# EAGLE design spectrumBit (EAGLE 9.5.2)
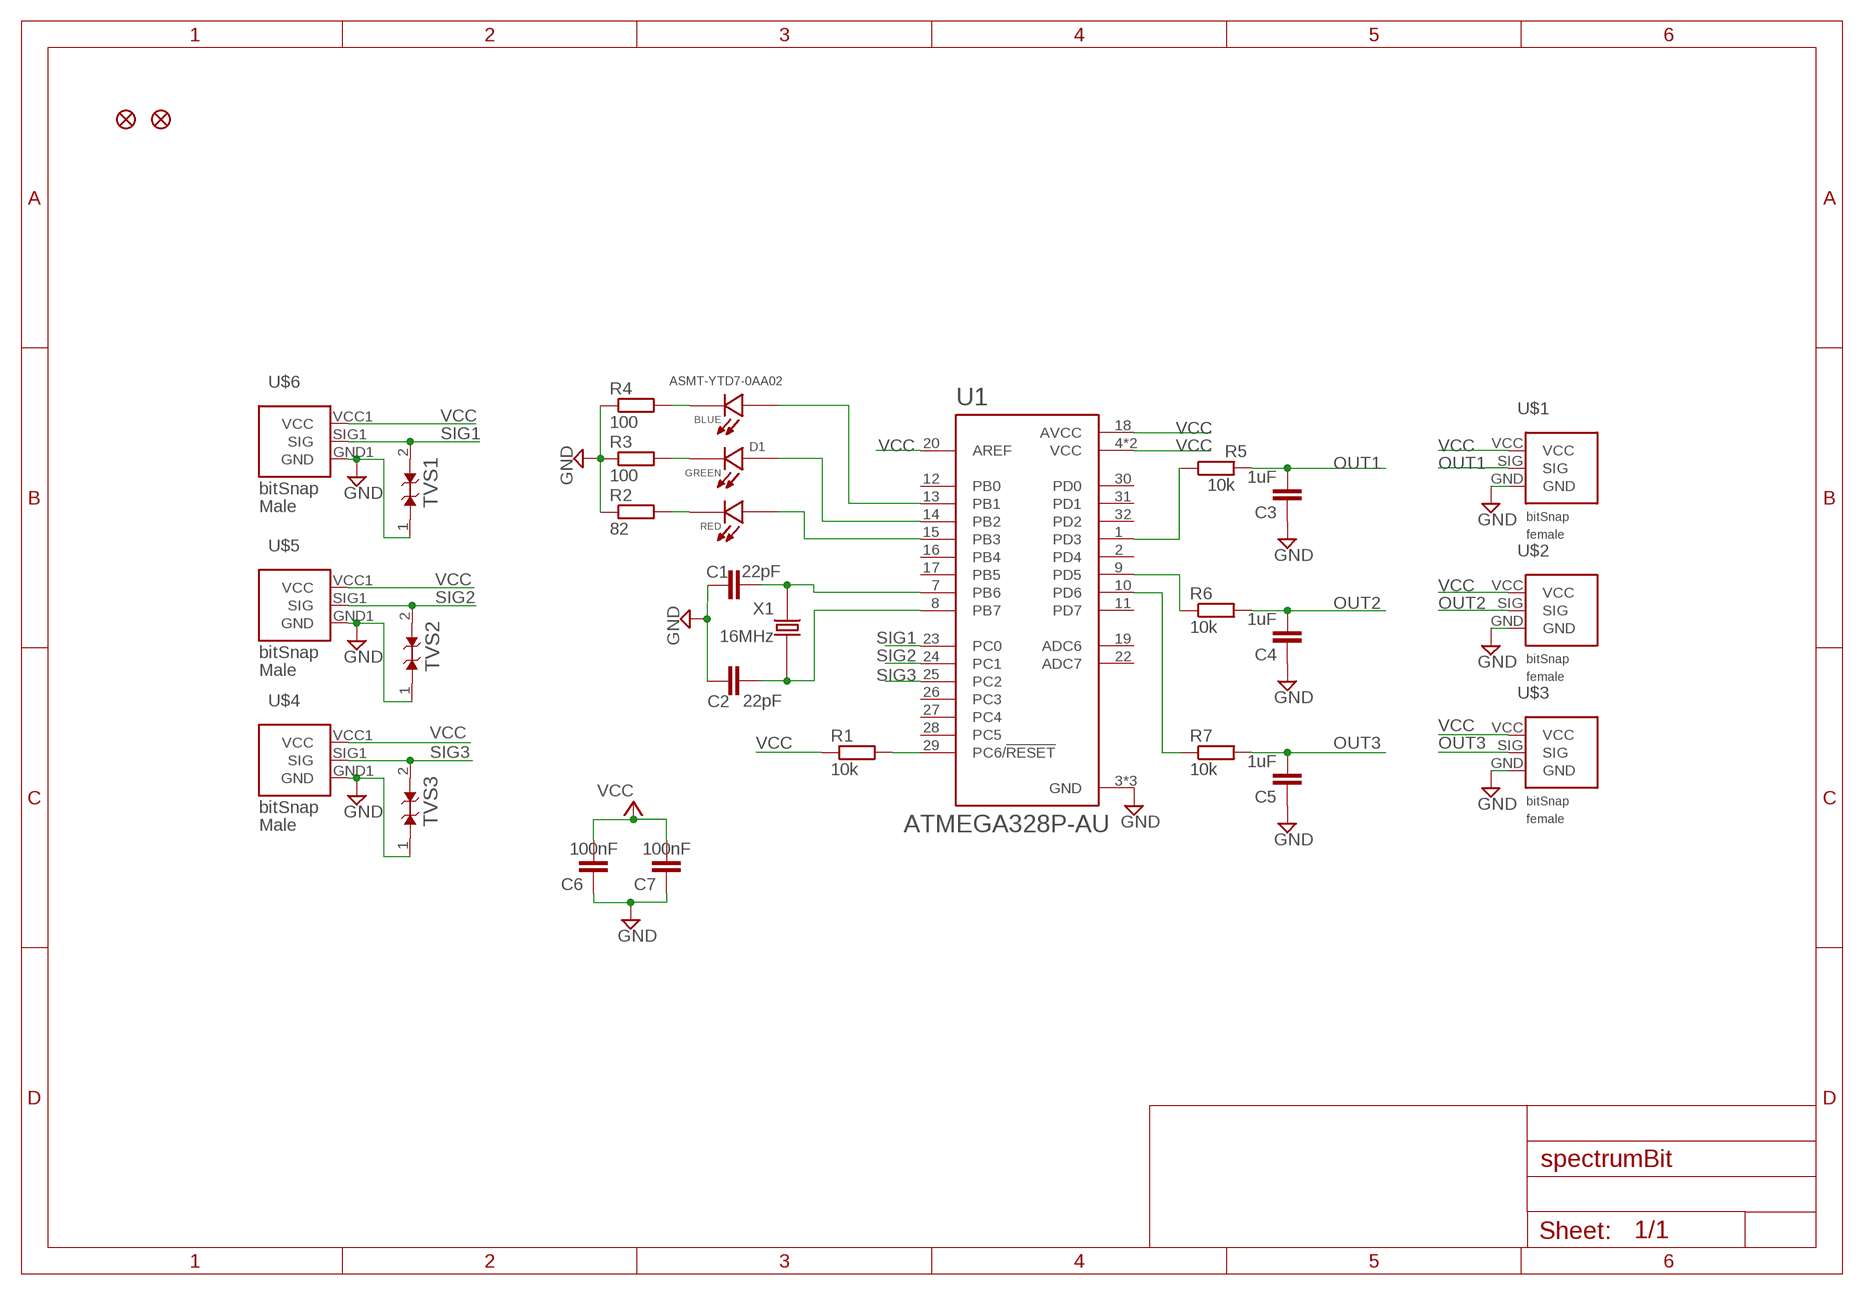
[diagram p0: schematic, sheet 1]

## Parts
C1  22pF  C-EUC0805  [C0805]
C2  22pF  C-EUC0805  [C0805]
C3  1uF  C-EUC0805  [C0805]
C4  1uF  C-EUC0805  [C0805]
C5  1uF  C-EUC0805  [C0805]
C6  100nF  C-EUC0805  [C0805]
C7  100nF  C-EUC0805  [C0805]
D1  ASMT-YTD7-0AA02  [LED_ASMT-YTD7-0AA02]
R1  10k  R-EU_R0805  [R0805]
R2  82  R-EU_R0805  [R0805]
R3  100  R-EU_R0805  [R0805]
R4  100  R-EU_R0805  [R0805]
R5  10k  R-EU_R0805  [R0805]
R6  10k  R-EU_R0805  [R0805]
R7  10k  R-EU_R0805  [R0805]
TVS1  ESD9B5.0ST5G  [SODFL1006X40N]
TVS2  ESD9B5.0ST5G  [SODFL1006X40N]
TVS3  ESD9B5.0ST5G  [SODFL1006X40N]
U1  ATMEGA328P-AU  [QFP80P900X900X120-32N]
U$1  BITSNAP_V03_FEMALE  [BITSNAP_V03_FEMALE]
U$2  BITSNAP_V03_FEMALE  [BITSNAP_V03_FEMALE]
U$3  BITSNAP_V03_FEMALE  [BITSNAP_V03_FEMALE]
U$4  BITSNAP_V03_MALE  [BITSNAP_V03_MALE]
U$5  BITSNAP_V03_MALE  [BITSNAP_V03_MALE]
U$6  BITSNAP_V03_MALE  [BITSNAP_V03_MALE]
U$7  FIDUCIAL  [FIDUCIAL1X2.5]
U$8  FIDUCIAL  [FIDUCIAL1X2.5]
X1  16MHz  7A-24.000MAAJ-T  [XTAL500X320X120]

## Nets
GND: C1.1 C2.1 C3.1 C4.1 C5.1 C6.1 C7.1 R2.1 R3.1 R4.1 TVS1.1(A) TVS2.1(A) TVS3.1(A) U1.3(GND) U1.5(GND) U1.21(GND) U$1.GND U$2.GND U$3.GND U$4.GND1(GND) U$5.GND1(GND) U$6.GND1(GND)
N$1: C2.2 U1.8(PB7) X1.1
N$2: C1.2 U1.7(PB6) X1.2
N$6: D1.6(B_A) U1.13(PB1)
N$7: D1.5(G_A) U1.14(PB2)
N$8: D1.4(R_A) U1.15(PB3)
N$9: R1.2 U1.29(PC6/!RESET)
N$10: D1.1(B_C) R4.2
N$11: D1.2(G_C) R3.2
N$12: D1.3(R_C) R2.2
N$14: R5.1 U1.1(PD3)
N$16: R6.1 U1.9(PD5)
N$18: R7.1 U1.10(PD6)
OUT1: C3.2 R5.2 U$1.SIG
OUT2: C4.2 R6.2 U$2.SIG
OUT3: C5.2 R7.2 U$3.SIG
SIG1: TVS1.2(A1) U1.23(PC0) U$6.SIG1(SIG)
SIG2: TVS2.2(A1) U1.24(PC1) U$5.SIG1(SIG)
SIG3: TVS3.2(A1) U1.25(PC2) U$4.SIG1(SIG)
VCC: C6.2 C7.2 R1.1 U1.4(VCC) U1.6(VCC) U1.18(AVCC) U1.20(AREF) U$1.VCC U$2.VCC U$3.VCC U$4.VCC1(VCC) U$5.VCC1(VCC) U$6.VCC1(VCC)
Unconnected: U1.2(PD4) U1.11(PD7) U1.12(PB0) U1.16(PB4) U1.17(PB5) U1.19(ADC6) U1.22(ADC7) U1.26(PC3) U1.27(PC4) U1.28(PC5) U1.30(PD0) U1.31(PD1) U1.32(PD2)

## Library data of the parts
C1-C7 = rcl:C-EU: CAPACITOR, European symbol; SPICEPREFIX: C
D1 = ASMT-YTD7-0AA02:ASMT-YTD7-0AA02: SMD LED RGB 1.8...3.6 V PLCC-6 | Broadcom ASMTYTD70AA02 @ LED, SMD (SMD LED RGB 1.8...3.6 V PLCC-6 LEDs – SMD).; AVAILABILITY: Unavailable; DESCRIPTION: Red, Green, Blue _RGB_ 623nm Red, 529nm Green, 469nm Blue LED Indication - Discrete 2.1V Red, 3.1V Green, 3.1V Blue 6-SMD, J-Lead; MF: Broadcom Limited; MP: ASMT-YTD7-0AA02; PACKAGE: PLCC-6 Broadcom; PRICE: None
R1-R7 = rcl:R-EU_: RESISTOR, European symbol; SPICEPREFIX: R
TVS1-TVS3 = ESD9B5.0ST5G:ESD9B5.0ST5G: ESD9B Series 7.8 V 15 pF Surface Mount TVS Diode - SOD-923; AVAILABILITY: Unavailable; DESCRIPTION: Clamp Ipp Tvs Diode Surface Mount SOD-923; MF: ON Semiconductor; MP: ESD9B5.0ST5G; PACKAGE: SOD-923 ON Semiconductor; PRICE: None
U1 = ATMEGA328P-AU:ATMEGA328P-AU: ATmega Series 20 MHz 32 KB Flash 2 KB SRAM 8-Bit Microcontroller - TQFP-32; AVAILABILITY: Unavailable; DESCRIPTION: AVR AVR® ATmega Microcontroller IC 8-Bit 20MHz 32KB _16K x 16_ FLASH 32-TQFP _7x7_; MF: Microchip Technology; MP: ATMEGA328P-AU; PACKAGE: TQFP-32 Microchip Technology; PRICE: None
U$1-U$3 = bitSnap140813:BITSNAP_V03_FEMALE
U$4-U$6 = bitSnap140813:BITSNAP_V03_MALE
U$7 U$8 = LITTLEBITS140915:FIDUCIAL
X1 = 7A-24.000MAAJ-T:7A-24.000MAAJ-T: Crystal 24MHz 30ppm (Tol) 30ppm (Stability) 18pF FUND 50Ohm 2-Pin SMD T/R; AVAILABILITY: Unavailable; DESCRIPTION: 24MHz ±30ppm Crystal 18pF 50 Ohms 2-SMD, No Lead; MF: TXC; MP: 7A-24.000MAAJ-T; PACKAGE: SMD-2 TXC; PRICE: None

## Board
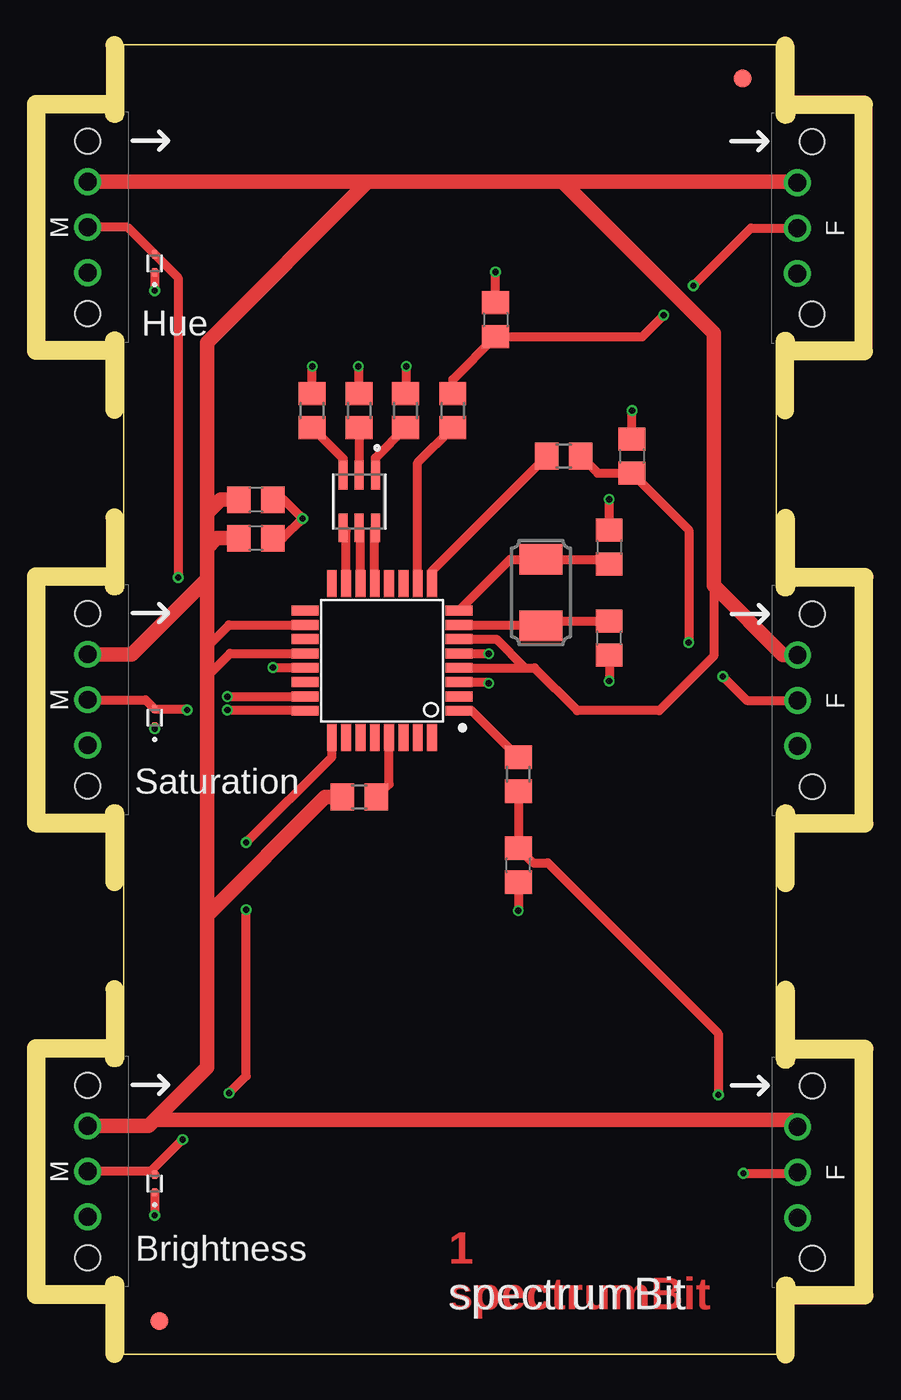
[diagram p1: board, top side]
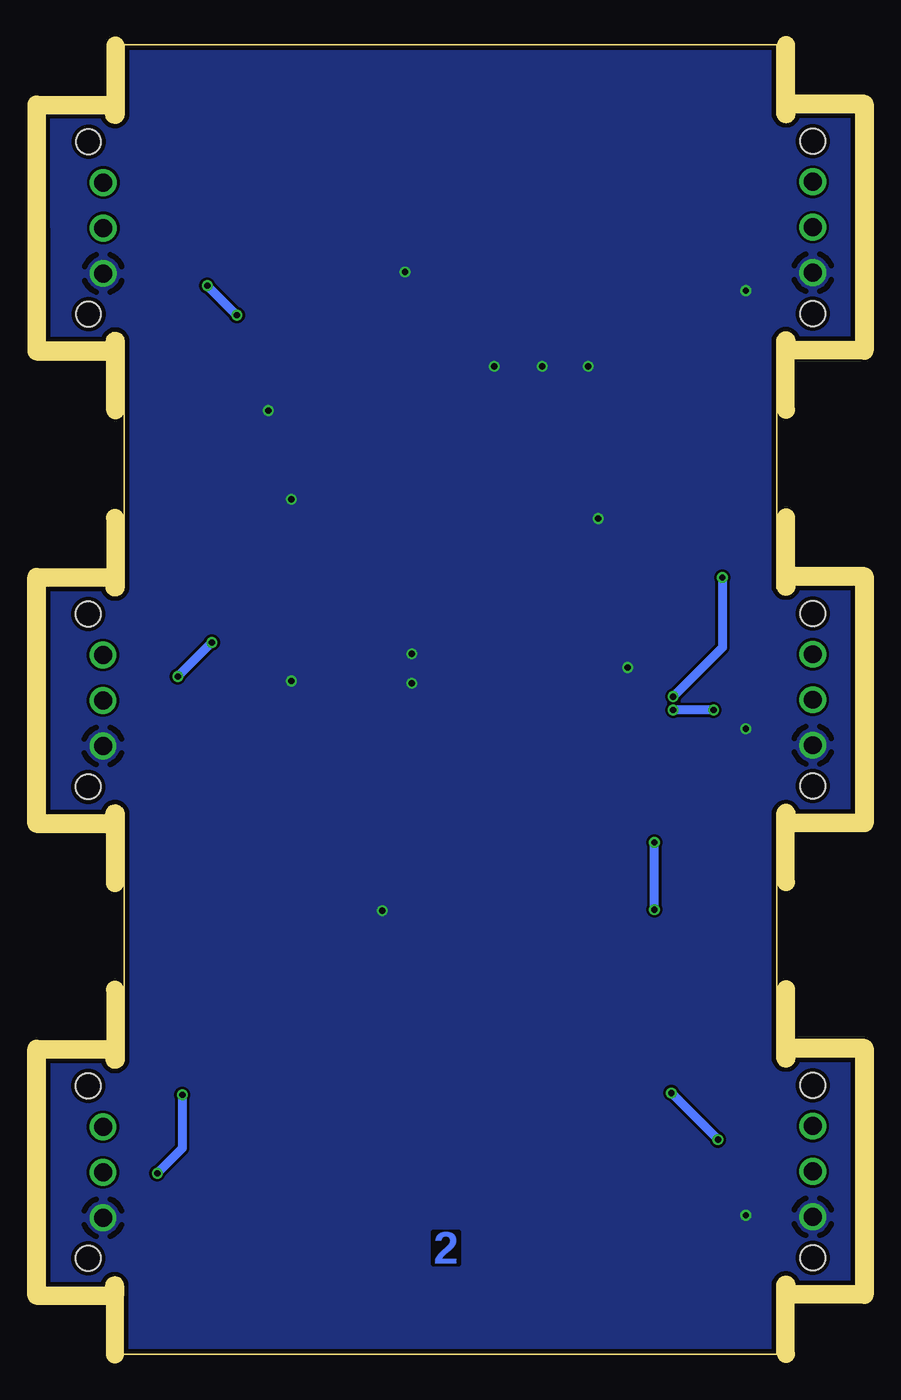
[diagram p2: board, bottom side, seen from below]

Size 45.33 x 73.2 mm. Coordinates in mm from the lower left corner, seen from the top.
Outline: 0,69.4 3.4,69.4 arc180 4.42,69.35 4.42,73.19 40.89,73.19 40.89,69.31 arc180 41.93,69.38 45.33,69.38 45.29,56.58 41.89,56.58 arc180 40.89,56.66 40.89,42.89 arc180 41.91,42.96 45.31,42.96 45.31,30.16 41.91,30.16 arc180 40.89,30.25 40.89,16.48 arc180 41.91,16.58 45.31,16.58 45.31,3.78 41.91,3.78 arc180 40.94,3.91 40.94,0.03 4.42,0.03 4.42,3.89 arc180 3.4,3.84 0,3.84 0,16.64 3.4,16.64 arc180 4.42,16.59 4.42,30.2 arc180 3.4,30.2 0,30.2 0,43 3.4,43 arc180 4.42,42.95 4.42,56.65 arc180 3.4,56.6 0,56.6 0,69.4
Copper layers (1*16): Top 0.018mm / dielectric 1.6mm / Bottom 0.018mm
Design rules "eC_2Layer_PClass6_BaseCopperO18_eCDefault *": minimum track width 0.15mm, minimum drill 0.35mm, track to track 0.15mm, track to pad 0.15mm, pad to pad 0.15mm, via to via 0.15mm, smd to smd 0mil, copper to edge 0.25mm, drill to drill 0.35mm, minimum pad ring 0.175mm, minimum via ring 0.125mm, stop-mask expansion 0mil, vias tented up to drill 0.45mm, thermal gap 0.2mm

### Footprints (pad centres in the part's own frame; a part is rotated, then mirrored left to right if it is on the bottom)
C0805 = smd 1.3 x 1.5: 1 -0.95,0; 2 0.95,0
LED_ASMT-YTD7-0AA02 = smd 1.6 x 0.5: 1 -1.475,0.9; 2 -1.475,0; 3 -1.475,-0.9; 4 1.475,-0.9; 5 1.475,0; 6 1.475,0.9
R0805 = smd 1.3 x 1.5: 1 -0.95,0; 2 0.95,0
SODFL1006X40N = smd 0.5 x 0.3: 1 -0.5,0; 2 0.5,0
QFP80P900X900X120-32N = smd 1.5 x 0.55: 1 -4.3,2.8; 2 -4.3,2; 3 -4.3,1.2; 4 -4.3,0.4; 5 -4.3,-0.4; 6 -4.3,-1.2; 7 -4.3,-2; 8 -4.3,-2.8; 17 4.3,-2.8; 18 4.3,-2; 19 4.3,-1.2; 20 4.3,-0.4; 21 4.3,0.4; 22 4.3,1.2; 23 4.3,2; 24 4.3,2.8 | smd 0.55 x 1.5: 9 -2.8,-4.3; 10 -2,-4.3; 11 -1.2,-4.3; 12 -0.4,-4.3; 13 0.4,-4.3; 14 1.2,-4.3; 15 2,-4.3; 16 2.8,-4.3; 25 2.8,4.3; 26 2,4.3; 27 1.2,4.3; 28 0.4,4.3; 29 -0.4,4.3; 30 -1.2,4.3; 31 -2,4.3; 32 -2.8,4.3
BITSNAP_V03_FEMALE = drill 1: GND 4.065,3.44; SIG 6.605,3.44; VCC 9.145,3.44 | hole 1.4: 1.785,2.61; 11.425,2.61
BITSNAP_V03_MALE = drill 1: GND1 9.145,2.61; SIG1 6.605,2.61; VCC1 4.065,2.61 | hole 1.4: 1.785,2.61; 11.425,2.61
FIDUCIAL1X2.5 = smd 1 x 1: 1 0,0
XTAL500X320X120 = smd 1.7 x 2.4: 1 -1.85,0; 2 1.85,0

### Placement (x,y rotation side)
C1  31.55,40.05 90 top
C2  31.55,45.13 270 top
C3  26.47,27.36 90 top
C4  32.82,50.22 270 top
C5  25.2,57.84 270 top
C6  11.81,47.77 180 top
C7  11.81,45.62 180 top
D1  17.58,47.67 270 top
R1  17.58,31.16 0 top
R2  14.94,52.76 270 top
R3  17.58,52.76 270 top
R4  20.17,52.76 270 top
R5  26.47,32.44 270 top
R6  29.01,50.22 0 top
R7  22.81,52.76 90 top
TVS1  6.15,60.98 90 top
TVS2  6.15,35.59 90 top
TVS3  6.15,9.57 90 top
U1  18.85,38.78 180 top
U$1  45.52,3.6 90 top
U$2  45.52,29.95 90 top
U$3  45.5,56.35 90 top
U$4  -0.2,16.84 270 top
U$5  -0.2,43.2 270 top
U$6  -0.2,69.61 270 top
U$7  6.41,1.88 0 top
U$8  39.01,71.33 0 top
X1  27.74,42.59 270 top

### Tracks (layer width: path | path; a pad name or v marks a point on that pad's centre or on a via)
GND  (via drill 0.35)
  Top 0.508: U1.5 24.8,39.19 v24.82,39.17 | C2.1 v31.55,47.8 | C1.1 v31.55,37.64 | TVS1.1 v6.15,59.46 | v17.53,55.23 17.53,53.76 R3.1 | C5.1 v25.2,60.5 | U1.21 12.77,38.38 v12.75,38.4 | TVS2.1 v6.15,34.98 | U1.3 24.75,37.59 v24.82,37.52 | C3.1 v26.47,24.82 | TVS3.1 v6.15,7.8 | C7.1 13.31,45.62 v14.41,46.73 13.36,47.77 C6.1 | R2.1 14.94,55.2 v14.96,55.23 | R4.1 20.21,53.74 v20.21,55.23 | v32.84,52.75 32.82,52.73 C4.1
  pour Bottom (no thermals): -1.39,74.78 46.86,74.78 46.86,-1.77 -1.39,-1.77
N$1
  Top 0.508: U1.8 26.01,44.45 X1.1 31.29,44.45 C2.2
N$2
  Top 0.508: U1.7 27.74,40.78 X1.2 28,41.01 C1.2
N$6
  Top 0.508: U1.13 18.45,46.17 D1.6
N$7
  Top 0.508: U1.14 17.65,46.13 D1.5
N$8
  Top 0.508: U1.15 16.85,46.03 D1.4
N$9
  Top 0.508: R1.2 19.25,31.88 U1.29
N$10
  Top 0.508: D1.1 18.48,50.12 R4.2
N$11
  Top 0.508: R3.2 D1.2
N$12
  Top 0.508: D1.3 16.68,50.06 R2.2
N$14
  Top 0.508: U1.1 23.87,35.98 R5.1
N$16
  Top 0.508: U1.9 21.65,43.8 R6.1
N$18
  Top 0.508: U1.10 20.85,49.84 R7.1
OUT1  (via drill 0.35)
  Top 0.508: R5.2 C3.2 27.29,27.48 28.12,27.48 37.64,17.96 v37.64,14.53 | v39.04,10.14 42.02,10.14 U$1.SIG
  Bottom 0.508: v37.64,14.53 37.64,11.54 v39.04,10.14
OUT2  (via drill 0.35)
  Top 0.508: R6.2 30.91,49.27 C4.2 35.99,46.09 v35.99,39.8 | v37.9,37.9 39.23,36.56 U$2.SIG
  Bottom 0.508: v35.99,39.8 v37.9,37.9
OUT3  (via drill 0.35)
  Top 0.508: R7.2 22.81,54.49 C5.2 33.39,56.88 v34.59,58.09 | v36.24,59.74 39.47,62.96 U$3.SIG
  Bottom 0.508: v34.59,58.09 v36.24,59.74
SIG1  (via drill 0.35)
  Top 0.508: U$6.SIG1 4.63,63 TVS1.2 7.46,60.17 v7.46,43.42 | v10.21,36.77 U1.23
  Bottom 0.508: v7.46,43.42 7.46,39.52 v10.21,36.77
SIG2  (via drill 0.35)
  Top 0.508: U$5.SIG1 5.63,36.6 TVS2.2 7.9,36.09 v7.96,36.02 | v10.21,36.02 14.51,36.02 U1.24
  Bottom 0.508: v7.96,36.02 v10.21,36.02
SIG3  (via drill 0.35)
  Top 0.508: TVS3.2 5.98,10.24 | 5.98,10.24 U$4.SIG1 | 5.98,10.24 5.98,10.3 v7.71,12.03 | v10.31,14.62 11.26,15.57 v11.26,24.88 | v11.26,28.62 16.05,33.41 U1.25
  Bottom 0.508: v7.71,12.03 v10.31,14.62 | v11.26,24.88 v11.26,28.62
VCC
  Top 0.508: 9.07,37.9 10.36,39.19 U1.20 | 9.07,39.55 10.3,40.78 U1.18 | 26.85,38.38 27.37,38.38 29.77,35.99 34.34,35.99 37.39,39.04 37.39,42.98 | 26.85,38.38 25.25,39.98 U1.6 | U1.4 26.85,38.38
  Top 0.813: 18.04,65.54 28.92,65.54 | 28.92,65.54 37.39,57.07 37.39,42.98 41.26,39.1 U$2.VCC | 9.07,43.36 9.07,45.08 | 9.07,47.02 9.07,45.08 | 9.07,47.02 9.07,56.56 18.04,65.54 | 9.07,43.36 4.85,39.14 U$5.VCC1 | 6.15,13.13 41.69,13.13 U$1.VCC | 6.15,13.13 5.8,12.78 U$4.VCC1 | 6.15,13.13 9.07,16.05 9.07,24.56 | 9.07,24.56 9.07,37.9 9.07,39.55 9.07,43.36 | 9.07,24.56 15.67,31.16 R1.1 | U$6.VCC1 18.04,65.54 | 9.07,47.02 9.82,47.77 C6.2 | 9.07,45.08 9.62,45.62 C7.2 | 28.92,65.54 42.02,65.54 U$3.VCC

### Text on the board
Top: 1 | spectrumBit
Bottom: 2
tPlace: Hue | Saturation | Brightness | spectrumBit